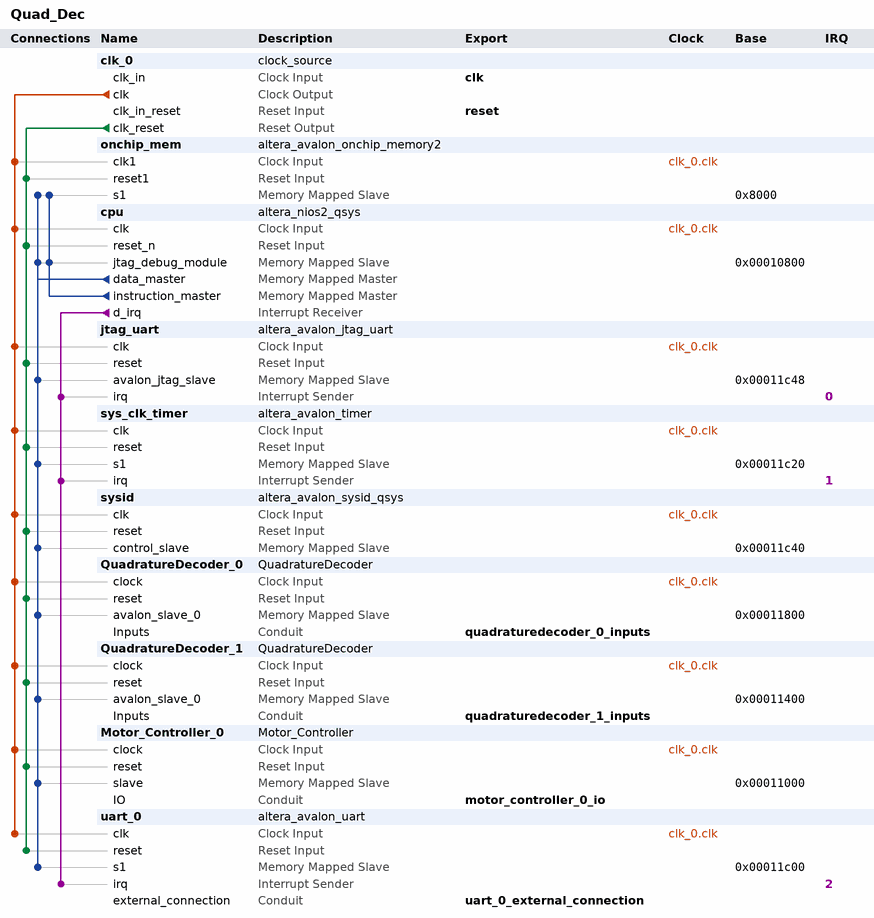
[diagram p0: system contents]
# Platform Designer (Qsys) system Quad_Dec, Cyclone IV E EP4CE22F17C6
# Parameters at their usual value, and those the tool derives, are not listed.
package require -exact qsys 13.1
create_system Quad_Dec
set_project_property DEVICE_FAMILY {Cyclone IV E}
set_project_property DEVICE EP4CE22F17C6

add_instance clk_0 clock_source 13.1
set_instance_parameter_value clk_0 clockFrequency 50000000

add_instance onchip_mem altera_avalon_onchip_memory2 13.1
set_instance_parameter_value onchip_mem dataWidth 32
set_instance_parameter_value onchip_mem dualPort false
set_instance_parameter_value onchip_mem initMemContent true
set_instance_parameter_value onchip_mem initializationFileName onchip_mem.hex
set_instance_parameter_value onchip_mem memorySize 20480

add_instance cpu altera_nios2_qsys 13.1
set_instance_parameter_value cpu resetSlave onchip_mem.s1
set_instance_parameter_value cpu mmu_TLBMissExcSlave None
set_instance_parameter_value cpu exceptionSlave onchip_mem.s1
set_instance_parameter_value cpu breakSlave cpu.jtag_debug_module
set_instance_parameter_value cpu muldiv_multiplierType NoneSmall
set_instance_parameter_value cpu impl Small
set_instance_parameter_value cpu icache_size 4096

add_instance jtag_uart altera_avalon_jtag_uart 13.1
set_instance_parameter_value jtag_uart simInteractiveOptions NO_INTERACTIVE_WINDOWS

add_instance sys_clk_timer altera_avalon_timer 13.1
set_instance_parameter_value sys_clk_timer period 1
set_instance_parameter_value sys_clk_timer periodUnits MSEC

add_instance sysid altera_avalon_sysid_qsys 13.1
set_instance_parameter_value sysid id 0

add_instance QuadratureDecoder_0 QuadratureDecoder 1.0
set_instance_parameter_value QuadratureDecoder_0 DATA_WIDTH 32

add_instance QuadratureDecoder_1 QuadratureDecoder 1.0
set_instance_parameter_value QuadratureDecoder_1 DATA_WIDTH 32

add_instance Motor_Controller_0 Motor_Controller 1.0
set_instance_parameter_value Motor_Controller_0 DATA_WIDTH 32
set_instance_parameter_value Motor_Controller_0 pwm_frequency 20000

add_instance uart_0 altera_avalon_uart 13.1
set_instance_parameter_value uart_0 baud 115200
set_instance_parameter_value uart_0 dataBits 8
set_instance_parameter_value uart_0 fixedBaud true
set_instance_parameter_value uart_0 parity NONE
set_instance_parameter_value uart_0 stopBits 1

# connections
add_connection clk_0.clk cpu.clk clock
add_connection clk_0.clk jtag_uart.clk clock
add_connection clk_0.clk Motor_Controller_0.clock clock
add_connection clk_0.clk onchip_mem.clk1 clock
add_connection clk_0.clk QuadratureDecoder_0.clock clock
add_connection clk_0.clk QuadratureDecoder_1.clock clock
add_connection clk_0.clk sys_clk_timer.clk clock
add_connection clk_0.clk sysid.clk clock
add_connection clk_0.clk uart_0.clk clock
add_connection clk_0.clk_reset cpu.reset_n reset
add_connection clk_0.clk_reset jtag_uart.reset reset
add_connection clk_0.clk_reset Motor_Controller_0.reset reset
add_connection clk_0.clk_reset onchip_mem.reset1 reset
add_connection clk_0.clk_reset QuadratureDecoder_0.reset reset
add_connection clk_0.clk_reset QuadratureDecoder_1.reset reset
add_connection clk_0.clk_reset sys_clk_timer.reset reset
add_connection clk_0.clk_reset sysid.reset reset
add_connection clk_0.clk_reset uart_0.reset reset
add_connection cpu.data_master cpu.jtag_debug_module avalon
set_connection_parameter_value cpu.data_master/cpu.jtag_debug_module baseAddress 0x00010800
add_connection cpu.data_master jtag_uart.avalon_jtag_slave avalon
set_connection_parameter_value cpu.data_master/jtag_uart.avalon_jtag_slave baseAddress 0x00011c48
add_connection cpu.data_master Motor_Controller_0.slave avalon
set_connection_parameter_value cpu.data_master/Motor_Controller_0.slave baseAddress 0x00011000
add_connection cpu.data_master onchip_mem.s1 avalon
set_connection_parameter_value cpu.data_master/onchip_mem.s1 baseAddress 0x8000
add_connection cpu.data_master QuadratureDecoder_0.avalon_slave_0 avalon
set_connection_parameter_value cpu.data_master/QuadratureDecoder_0.avalon_slave_0 baseAddress 0x00011800
add_connection cpu.data_master QuadratureDecoder_1.avalon_slave_0 avalon
set_connection_parameter_value cpu.data_master/QuadratureDecoder_1.avalon_slave_0 baseAddress 0x00011400
add_connection cpu.data_master sys_clk_timer.s1 avalon
set_connection_parameter_value cpu.data_master/sys_clk_timer.s1 baseAddress 0x00011c20
add_connection cpu.data_master sysid.control_slave avalon
set_connection_parameter_value cpu.data_master/sysid.control_slave baseAddress 0x00011c40
add_connection cpu.data_master uart_0.s1 avalon
set_connection_parameter_value cpu.data_master/uart_0.s1 baseAddress 0x00011c00
add_connection cpu.instruction_master cpu.jtag_debug_module avalon
set_connection_parameter_value cpu.instruction_master/cpu.jtag_debug_module baseAddress 0x00010800
add_connection cpu.instruction_master onchip_mem.s1 avalon
set_connection_parameter_value cpu.instruction_master/onchip_mem.s1 baseAddress 0x8000
add_connection cpu.d_irq jtag_uart.irq interrupt
set_connection_parameter_value cpu.d_irq/jtag_uart.irq irqNumber 0
add_connection cpu.d_irq sys_clk_timer.irq interrupt
set_connection_parameter_value cpu.d_irq/sys_clk_timer.irq irqNumber 1
add_connection cpu.d_irq uart_0.irq interrupt
set_connection_parameter_value cpu.d_irq/uart_0.irq irqNumber 2

# exported interfaces
add_interface clk clock sink
set_interface_property clk EXPORT_OF clk_0.clk_in
add_interface reset reset sink
set_interface_property reset EXPORT_OF clk_0.clk_in_reset
add_interface quadraturedecoder_0_inputs conduit end
set_interface_property quadraturedecoder_0_inputs EXPORT_OF QuadratureDecoder_0.Inputs
add_interface quadraturedecoder_1_inputs conduit end
set_interface_property quadraturedecoder_1_inputs EXPORT_OF QuadratureDecoder_1.Inputs
add_interface motor_controller_0_io conduit end
set_interface_property motor_controller_0_io EXPORT_OF Motor_Controller_0.IO
add_interface uart_0_external_connection conduit end
set_interface_property uart_0_external_connection EXPORT_OF uart_0.external_connection

set_interconnect_requirement {$system} qsys_mm.clockCrossingAdapter HANDSHAKE
set_interconnect_requirement {$system} qsys_mm.maxAdditionalLatency 1
set_interconnect_requirement {$system} qsys_mm.insertDefaultSlave false

save_system Quad_Dec.qsys
